# EAGLE design CPLD (EAGLE 7.5.0)
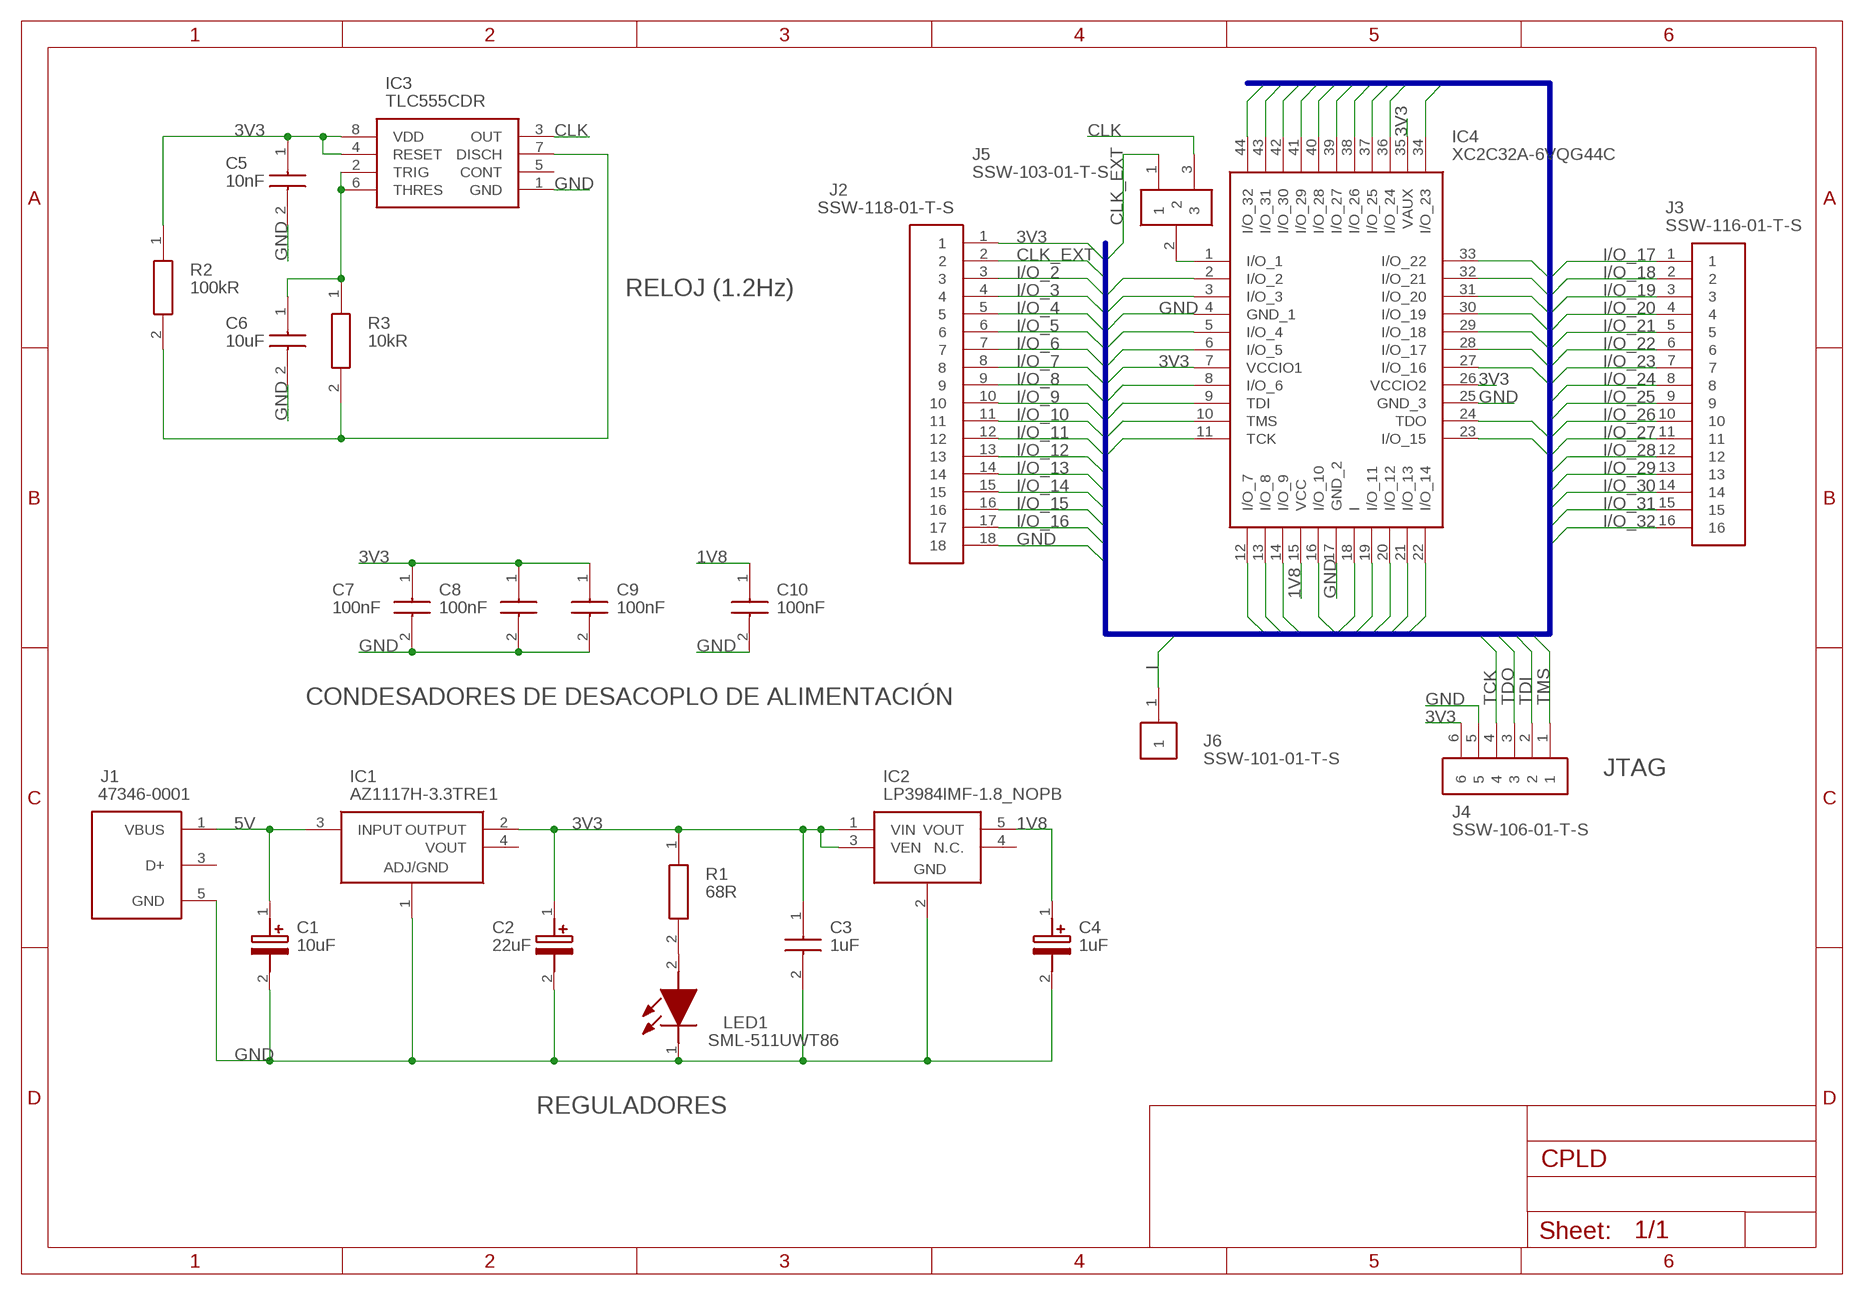
[diagram p0: schematic, sheet 1]

## Parts
C1  10uF  293D106X9016A2TE3  [CAPPM3216X180N]
C2  22uF  293D226X9010A2TE3  [CAPPM3216X180N]
C3  1uF  0603ZD105KAT2A  [CAPC1608X90N]
C4  1uF  TAJA105K020RNJ  [CAPPM3216X180N]
C5  10nF  C0603C103K5RACTU  [CAPC1608X87N]
C6  10uF  C1608X5R0J106K080AB  [C1608_COMMERCIAL]
C7  100nF  C0603C104K4RACTU  [CAPC1608X95N]
C8  100nF  C0603C104K4RACTU  [CAPC1608X95N]
C9  100nF  C0603C104K4RACTU  [CAPC1608X95N]
C10  100nF  C0603C104K4RACTU  [CAPC1608X95N]
IC1  AZ1117H-3.3TRE1  [SOT230P700X180-4N]
IC2  LP3984IMF-1.8_NOPB  [SOT95P280X145-5N]
IC3  TLC555CDR  [SOIC127P600X175-8N]
IC4  XC2C32A-6VQG44C  [QFP80P1200X1200X120-44N]
J1  47346-0001  [47346-0001]
J2  SSW-118-01-T-S  [SAMTEC_SSW-118-01-T-S]
J3  SSW-116-01-T-S  [SAMTEC_SSW-116-01-T-S]
J4  SSW-106-01-T-S  [SAMTEC_SSW-106-01-T-S]
J5  SSW-103-01-T-S  [SAMTEC_SSW-103-01-T-S]
J6  SSW-101-01-T-S  [SSW-101-XX-YYY-S]
LED1  SML-511UWT86  [LEDC1608X65N]
R1  68R  CRG0603F68R  [RESC1608X55N]
R2  100kR  CRG0603F100K  [RESC1608X55N]
R3  10kR  CRCW060310K0FKEA  [RESC1608X50N]

## Nets
1V8 [Power]: C4.1(+) C10.1 IC2.5(VOUT) IC4.15(VCC)
3V3 [Power]: C2.1(+) C3.1 C5.1 C7.1 C8.1 C9.1 IC1.2(OUTPUT) IC2.1(VIN) IC2.3(VEN) IC3.4(RESET) IC3.8(VDD) IC4.7(VCCIO1) IC4.26(VCCIO2) IC4.35(VAUX) J2.1 J4.6 R1.1 R2.1
5V [Power]: C1.1(+) IC1.3(INPUT) J1.1(VBUS)
CLK [Signal]: IC3.3(OUT) J5.3
CLK_EXT [Signal]: J2.2 J5.1
GND [Power]: C1.2(-) C2.2(-) C3.2 C4.2(-) C5.2 C6.2 C7.2 C8.2 C9.2 C10.2 IC1.1(ADJ/GND) IC2.2(GND) IC3.1(GND) IC4.4(GND_1) IC4.17(GND_2) IC4.25(GND_3) J1.5(GND) J2.18 J4.5 LED1.1(K)
I: IC4.18(I) J6.1
I/O_2 [Signal]: IC4.2(I/O_2) J2.3
I/O_3 [Signal]: IC4.3(I/O_3) J2.4
I/O_4 [Signal]: IC4.5(I/O_4) J2.5
I/O_5 [Signal]: IC4.6(I/O_5) J2.6
I/O_6 [Signal]: IC4.8(I/O_6) J2.7
I/O_7 [Signal]: IC4.12(I/O_7) J2.8
I/O_8 [Signal]: IC4.13(I/O_8) J2.9
I/O_9 [Signal]: IC4.14(I/O_9) J2.10
I/O_10 [Signal]: IC4.16(I/O_10) J2.11
I/O_11 [Signal]: IC4.19(I/O_11) J2.12
I/O_12 [Signal]: IC4.20(I/O_12) J2.13
I/O_13 [Signal]: IC4.21(I/O_13) J2.14
I/O_14 [Signal]: IC4.22(I/O_14) J2.15
I/O_15 [Signal]: IC4.23(I/O_15) J2.16
I/O_16 [Signal]: IC4.27(I/O_16) J2.17
I/O_17 [Signal]: IC4.28(I/O_17) J3.1
I/O_18 [Signal]: IC4.29(I/O_18) J3.2
I/O_19 [Signal]: IC4.30(I/O_19) J3.3
I/O_20 [Signal]: IC4.31(I/O_20) J3.4
I/O_21 [Signal]: IC4.32(I/O_21) J3.5
I/O_22 [Signal]: IC4.33(I/O_22) J3.6
I/O_23 [Signal]: IC4.34(I/O_23) J3.7
I/O_24 [Signal]: IC4.36(I/O_24) J3.8
I/O_25 [Signal]: IC4.37(I/O_25) J3.9
I/O_26 [Signal]: IC4.38(I/O_26) J3.10
I/O_27 [Signal]: IC4.39(I/O_27) J3.11
I/O_28 [Signal]: IC4.40(I/O_28) J3.12
I/O_29 [Signal]: IC4.41(I/O_29) J3.13
I/O_30 [Signal]: IC4.42(I/O_30) J3.14
I/O_31 [Signal]: IC4.43(I/O_31) J3.15
I/O_32 [Signal]: IC4.44(I/O_32) J3.16
N$3 [Signal]: C6.1 IC3.2(TRIG) IC3.6(THRES) R3.1
N$4: LED1.2(A) R1.2
N$5 [Signal]: IC3.7(DISCH) R2.2 R3.2
N$6 [Signal]: IC4.1(I/O_1) J5.2
TCK [Signal]: IC4.11(TCK) J4.4
TDI [Signal]: IC4.9(TDI) J4.2
TDO [Signal]: IC4.24(TDO) J4.3
TMS [Signal]: IC4.10(TMS) J4.1
Unconnected: IC1.4(VOUT) IC2.4(N.C.) IC3.5(CONT) J1.3(D+)

## Buses
I/O_[2..32],TDI,TMS,TCK,TDO,3V3,GND,CLK_EXT,I

## Notes on the sheet
- RELOJ (1.2Hz)
- CONDESADORES DE DESACOPLO DE ALIMENTACIÓN
- JTAG
- REGULADORES

## Library data of the parts
C1 = SamacSys_Parts:293D106X9016A2TE3: Capacitor Tantalum SMT 293D 16V 10uF Vishay 10uF SMD Solid MnO2 Tantalum Electrolytic Capacitor, 16 V dc +/-10%, 293D Series Source: Datasheet <http://uk.rs-online.com/web/p/products/6843890P>; ALLIED_NUMBER: 70212834; DESCRIPTION: Capacitor Tantalum SMT 293D 16V 10uF Vishay 10uF SMD Solid MnO2 Tantalum Electrolytic Capacitor, 16 V dc +/-10%, 293D Series; HEIGHT: 1.8mm; MANUFACTURER_NAME: Vishay; MANUFACTURER_PART_NUMBER: 293D106X9016A2TE3; RS_PART_NUMBER: 6843890P; RS_PRICE-STOCK: http://uk.rs-online.com/web/p/products/6843890P
C2 = SamacSys_Parts:293D226X9010A2TE3: Solid Tantalum Surface Mount Chip Capacitors TANTAMOUNT(TM), Molded Case, Standard Industrial Grade Source: Datasheet <http://uk.rs-online.com/web/p/products/6844017P>; ALLIED_NUMBER: 70398885; DESCRIPTION: Solid Tantalum Surface Mount Chip Capacitors TANTAMOUNT(TM), Molded Case, Standard Industrial Grade; HEIGHT: 1.8mm; MANUFACTURER_NAME: Vishay; MANUFACTURER_PART_NUMBER: 293D226X9010A2TE3; RS_PART_NUMBER: 6844017P; RS_PRICE-STOCK: http://uk.rs-online.com/web/p/products/6844017P
C3 = SamacSys_Parts:0603ZD105KAT2A: AVX 1uF /-10% 10 V dc X5R Dielectric SMD Ceramic Multilayer Capacitor 0603 Source: Datasheet <http://datasheets.avx.com/cx5r.pdf>; DESCRIPTION: AVX 1uF /-10% 10 V dc X5R Dielectric SMD Ceramic Multilayer Capacitor 0603; HEIGHT: 0.9mm; MANUFACTURER_NAME: AVX; MANUFACTURER_PART_NUMBER: 0603ZD105KAT2A; MOUSER_PART_NUMBER: 581-0603ZD105K; MOUSER_PRICE-STOCK: https://www.mouser.co.uk/ProductDetail/AVX/0603ZD105KAT2A?qs=9PmLU43%252BWwW9M7%2FQGmdczg%3D%3D
C4 = SamacSys_Parts:TAJA105K020RNJ: TAJ SMT tant capacitor,Case A,20V,1uF AVX /-10% 1uF 20 V dc SMD Tantalum Electrolytic Capacitor, 3216-18 ESR 9Ohm +125degC TAJ Source: Datasheet <http://uk.rs-online.com/web/p/products/4649053P>; ALLIED_NUMBER: 70002325; DESCRIPTION: TAJ SMT tant capacitor,Case A,20V,1uF AVX /-10% 1uF 20 V dc SMD Tantalum Electrolytic Capacitor, 3216-18 ESR 9Ohm +125degC TAJ; HEIGHT: 1.8mm; MANUFACTURER_NAME: AVX; MANUFACTURER_PART_NUMBER: TAJA105K020RNJ; RS_PART_NUMBER: 4649053P; RS_PRICE-STOCK: http://uk.rs-online.com/web/p/products/4649053P
C5 = SamacSys_Parts:C0603C103K5RACTU: 0603 X7R ceramic capacitor, 50V 10nF Kemet 0603 10nF Ceramic Multilayer Capacitor, 50V dc, 125C, X7R Dielectric, +/-10% SMD Source: Datasheet <http://uk.rs-online.com/web/p/products/2644595P>; ALLIED_NUMBER: 70096891; DESCRIPTION: 0603 X7R ceramic capacitor, 50V 10nF Kemet 0603 10nF Ceramic Multilayer Capacitor, 50V dc, 125C, X7R Dielectric, +/-10% SMD; HEIGHT: 0.87mm; MANUFACTURER_NAME: Kemet; MANUFACTURER_PART_NUMBER: C0603C103K5RACTU; RS_PART_NUMBER: 2644595P; RS_PRICE-STOCK: http://uk.rs-online.com/web/p/products/2644595P
C6 = SamacSys_Parts:C1608X5R0J106K080AB: MULTILAYER CERAMIC CHIP CAPACITORS, 1608, Commercial grade, general (Up to 75V) Source: Datasheet <http://uk.rs-online.com/web/p/products/7882887P>; DESCRIPTION: MULTILAYER CERAMIC CHIP CAPACITORS, 1608, Commercial grade, general (Up to 75V); HEIGHT: 0.9mm; MANUFACTURER_NAME: TDK; MANUFACTURER_PART_NUMBER: C1608X5R0J106K080AB; RS_PART_NUMBER: 7882887P; RS_PRICE-STOCK: http://uk.rs-online.com/web/p/products/7882887P
C7-C10 = SamacSys_Parts:C0603C104K4RACTU: 0603 X7R ceramic capacitor, 16V 100nF Kemet 0603 0.1??F Ceramic Multilayer Capacitor, 16V dc X7R Dielectric ??10% SMD Source: Datasheet <http://uk.rs-online.com/web/p/products/2644630P>; ALLIED_NUMBER: 70096893; DESCRIPTION: 0603 X7R ceramic capacitor, 16V 100nF Kemet 0603 0.1??F Ceramic Multilayer Capacitor, 16V dc X7R Dielectric ??10% SMD; HEIGHT: 0.95mm; MANUFACTURER_NAME: Kemet; MANUFACTURER_PART_NUMBER: C0603C104K4RACTU; RS_PART_NUMBER: 2644630P; RS_PRICE-STOCK: http://uk.rs-online.com/web/p/products/2644630P
IC1 = SamacSys_Parts:AZ1117H-3.3TRE1: 3.3V 1A Pos LDO Regulator SOT-223 DiodesZetex AZ1117H-3.3TRE1, LDO Voltage Regulator, 1A, 3.3 V 1%, maximum of 15 Vin, 3+Tab-Pin SOT-223 Source: Datasheet <http://uk.rs-online.com/web/p/products/9210701P>; DESCRIPTION: 3.3V 1A Pos LDO Regulator SOT-223 DiodesZetex AZ1117H-3.3TRE1, LDO Voltage Regulator, 1A, 3.3 V 1%, maximum of 15 Vin, 3+Tab-Pin SOT-223; HEIGHT: 1.8mm; MANUFACTURER_NAME: Diodes Inc.; MANUFACTURER_PART_NUMBER: AZ1117H-3.3TRE1; RS_PART_NUMBER: 9210701P; RS_PRICE-STOCK: http://uk.rs-online.com/web/p/products/9210701P
IC2 = SamacSys_Parts:LP3984IMF-1.8_NOPB: 150mA,1.8V,LDO Voltage Reg,LP3984IMF-1.8 Source: Datasheet <http://uk.rs-online.com/web/p/products/5360830P>; DESCRIPTION: 150mA,1.8V,LDO Voltage Reg,LP3984IMF-1.8; HEIGHT: 1.45mm; MANUFACTURER_NAME: Texas Instruments; MANUFACTURER_PART_NUMBER: LP3984IMF-1.8/NOPB; RS_PART_NUMBER: 5360830P; RS_PRICE-STOCK: http://uk.rs-online.com/web/p/products/5360830P
IC3 = SamacSys_Parts:TLC555CDR: TLC555CDR, Timer 2MHz, 2 ??? 15 V, 8-Pin SOIC-8 Source: Datasheet <http://uk.rs-online.com/web/p/products/6624006P>; DESCRIPTION: TLC555CDR, Timer 2MHz, 2 ??? 15 V, 8-Pin SOIC-8; HEIGHT: 1.75mm; MANUFACTURER_NAME: Texas Instruments; MANUFACTURER_PART_NUMBER: TLC555CDR; RS_PART_NUMBER: 6624006P; RS_PRICE-STOCK: http://uk.rs-online.com/web/p/products/6624006P
IC4 = SamacSys_Parts:XC2C32A-6VQG44C: CoolRunner II 32 macrocells VQFP XC2C32A-6VQG44C, CPLD CoolRunner II 32 Cells, 33 I/O, 2 Labs, ISP, 1.7 1.9 V 44-Pin VTQFP Source: Datasheet <https://www.xilinx.com/support/documentation/package_specs/vq44.pdf>; DESCRIPTION: CoolRunner II 32 macrocells VQFP XC2C32A-6VQG44C, CPLD CoolRunner II 32 Cells, 33 I/O, 2 Labs, ISP, 1.7 1.9 V 44-Pin VTQFP; HEIGHT: 1.2mm; MANUFACTURER_NAME: XILINX; MANUFACTURER_PART_NUMBER: XC2C32A-6VQG44C; MOUSER_PART_NUMBER: 217-XC2C32A-6VQG44C; MOUSER_PRICE-STOCK: https://www.mouser.co.uk/ProductDetail/Xilinx/XC2C32A-6VQG44C?qs=rrS6PyfT74eChICnO6BLUg%3D%3D
J1 = SamacSys_Parts:47346-0001: Micro USB B Receptacle Bottom Mount Assy Molex Right Angle SMT Type B Version 2.0 Micro USB Connector Socket, 30 V ac, 1A 47352 MICRO-USB Source: Datasheet <http://www.molex.com/pdm_docs/sd/473460001_sd.pdf>; DESCRIPTION: Micro USB B Receptacle Bottom Mount Assy Molex Right Angle SMT Type B Version 2.0 Micro USB Connector Socket, 30 V ac, 1A 47352 MICRO-USB; HEIGHT: mm; MANUFACTURER_NAME: Molex; MANUFACTURER_PART_NUMBER: 47346-0001; MOUSER_PART_NUMBER: 538-47346-0001; MOUSER_PRICE-STOCK: https://www.mouser.co.uk/ProductDetail/Molex/47346-0001?qs=c2CV6XM0DweJBWaSeyWeCw%3D%3D
J2 = SamacSys_Parts:SSW-118-01-T-S: 18 Position, .100" Tiger Buy™ Socket Strip Source: Datasheet <http://suddendocs.samtec.com/prints/ssw-1xx-xx-xxx-x-xx-xxx-xx-mkt.pdf>; DESCRIPTION: 18 Position, .100&quot; Tiger Buy&trade; Socket Strip; HEIGHT: mm; MANUFACTURER_NAME: SAMTEC; MANUFACTURER_PART_NUMBER: SSW-118-01-T-S; MOUSER_PART_NUMBER: 200-SSW11801TS; MOUSER_PRICE-STOCK: https://www.mouser.co.uk/ProductDetail/Samtec/SSW-118-01-T-S?qs=rU5fayqh%252BE3cHws7SblMBw%3D%3D
J3 = SamacSys_Parts:SSW-116-01-T-S: 16 Position, .100" Tiger Buy™ Socket Strip Source: Datasheet <http://uk.rs-online.com/web/p/products/1800453>; DESCRIPTION: 16 Position, .100&quot; Tiger Buy&trade; Socket Strip; HEIGHT: mm; MANUFACTURER_NAME: SAMTEC; MANUFACTURER_PART_NUMBER: SSW-116-01-T-S; RS_PART_NUMBER: 1800453; RS_PRICE-STOCK: http://uk.rs-online.com/web/p/products/1800453
J4 = SamacSys_Parts:SSW-106-01-T-S: 6 Position, .100" Tiger Buy™ Socket Strip Source: Datasheet <http://uk.rs-online.com/web/p/products/1557894>; DESCRIPTION: 6 Position, .100&quot; Tiger Buy&trade; Socket Strip; HEIGHT: mm; MANUFACTURER_NAME: SAMTEC; MANUFACTURER_PART_NUMBER: SSW-106-01-T-S; RS_PART_NUMBER: 1557894; RS_PRICE-STOCK: http://uk.rs-online.com/web/p/products/1557894
J5 = SamacSys_Parts:SSW-103-01-T-S: 3 Position, .100" Tiger Buy™ Socket Strip Source: Datasheet <http://uk.rs-online.com/web/p/products/1800408>; DESCRIPTION: 3 Position, .100&quot; Tiger Buy&trade; Socket Strip; HEIGHT: mm; MANUFACTURER_NAME: SAMTEC; MANUFACTURER_PART_NUMBER: SSW-103-01-T-S; RS_PART_NUMBER: 1800408; RS_PRICE-STOCK: http://uk.rs-online.com/web/p/products/1800408
J6 = SamacSys_Parts:SSW-101-01-T-S: 1 Position, .100" Tiger Buy™ Socket Strip Source: Datasheet <http://suddendocs.samtec.com/prints/ssw-1xx-xx-xxx-x-xx-xxx-xx-mkt.pdf>; DESCRIPTION: 1 Position, .100&quot; Tiger Buy&trade; Socket Strip; HEIGHT: mm; MANUFACTURER_NAME: SAMTEC; MANUFACTURER_PART_NUMBER: SSW-101-01-T-S; MOUSER_PART_NUMBER: 200-SSW10101TS; MOUSER_PRICE-STOCK: https://www.mouser.co.uk/ProductDetail/Samtec/SSW-101-01-T-S/?qs=rU5fayqh%252BE2KqcuVZzybJQ%3D%3D
LED1 = SamacSys_Parts:SML-511UWT86: ROHM SML-511UWT86, SML-51 Series Red LED, 1608 (0603), Rectangle Lens SMD Package Source: Datasheet <http://uk.rs-online.com/web/p/products/7007966P>; ALLIED_NUMBER: 70522043; DESCRIPTION: ROHM SML-511UWT86, SML-51 Series Red LED, 1608 (0603), Rectangle Lens SMD Package; HEIGHT: 0.65mm; MANUFACTURER_NAME: ROHM Semiconductor; MANUFACTURER_PART_NUMBER: SML-511UWT86; RS_PART_NUMBER: 7007966P; RS_PRICE-STOCK: http://uk.rs-online.com/web/p/products/7007966P
R1 = SamacSys_Parts:CRG0603F68R: CRG0603 SMT chip resistor,68R 1% 0.1W TE Connectivity CRG0603 Series Thick Film Surface Mount Resistor 0603 Case 68 +/-1% 0.1W +/-200ppm/C Source: Datasheet <http://uk.rs-online.com/web/p/products/2132115P>; ALLIED_NUMBER: 70063170; DESCRIPTION: CRG0603 SMT chip resistor,68R 1% 0.1W TE Connectivity CRG0603 Series Thick Film Surface Mount Resistor 0603 Case 68 +/-1% 0.1W +/-200ppm/C; HEIGHT: 0.55mm; MANUFACTURER_NAME: TE Connectivity; MANUFACTURER_PART_NUMBER: CRG0603F68R; RS_PART_NUMBER: 2132115P; RS_PRICE-STOCK: http://uk.rs-online.com/web/p/products/2132115P
R2 = SamacSys_Parts:CRG0603F100K: CRG0603 SMT chip resistor,100K 1% 0.1W TE Connectivity CRG0603 Series Thick Film Surface Mount Resistor 0603 Case 100k +/-1% 0.1W +/-100ppm/C Source: Datasheet <http://uk.rs-online.com/web/p/products/2132531P>; ALLIED_NUMBER: 70063119; DESCRIPTION: CRG0603 SMT chip resistor,100K 1% 0.1W TE Connectivity CRG0603 Series Thick Film Surface Mount Resistor 0603 Case 100k +/-1% 0.1W +/-100ppm/C; HEIGHT: 0.55mm; MANUFACTURER_NAME: TE Connectivity; MANUFACTURER_PART_NUMBER: CRG0603F100K; RS_PART_NUMBER: 2132531P; RS_PRICE-STOCK: http://uk.rs-online.com/web/p/products/2132531P
R3 = SamacSys_Parts:CRCW060310K0FKEA: CRCW0603 Resistor T/R 0.10W,1%,10K Vishay CRCW Series Thick Film Surface Mount Resistor 0603 Case 10k +/-1% 0.1W +/-100ppm/C Source: Datasheet <http://uk.rs-online.com/web/p/products/6789667P>; ALLIED_NUMBER: 70201153; DESCRIPTION: CRCW0603 Resistor T/R 0.10W,1%,10K Vishay CRCW Series Thick Film Surface Mount Resistor 0603 Case 10k +/-1% 0.1W +/-100ppm/C; HEIGHT: 0.5mm; MANUFACTURER_NAME: Vishay; MANUFACTURER_PART_NUMBER: CRCW060310K0FKEA; RS_PART_NUMBER: 6789667P; RS_PRICE-STOCK: http://uk.rs-online.com/web/p/products/6789667P

## Board
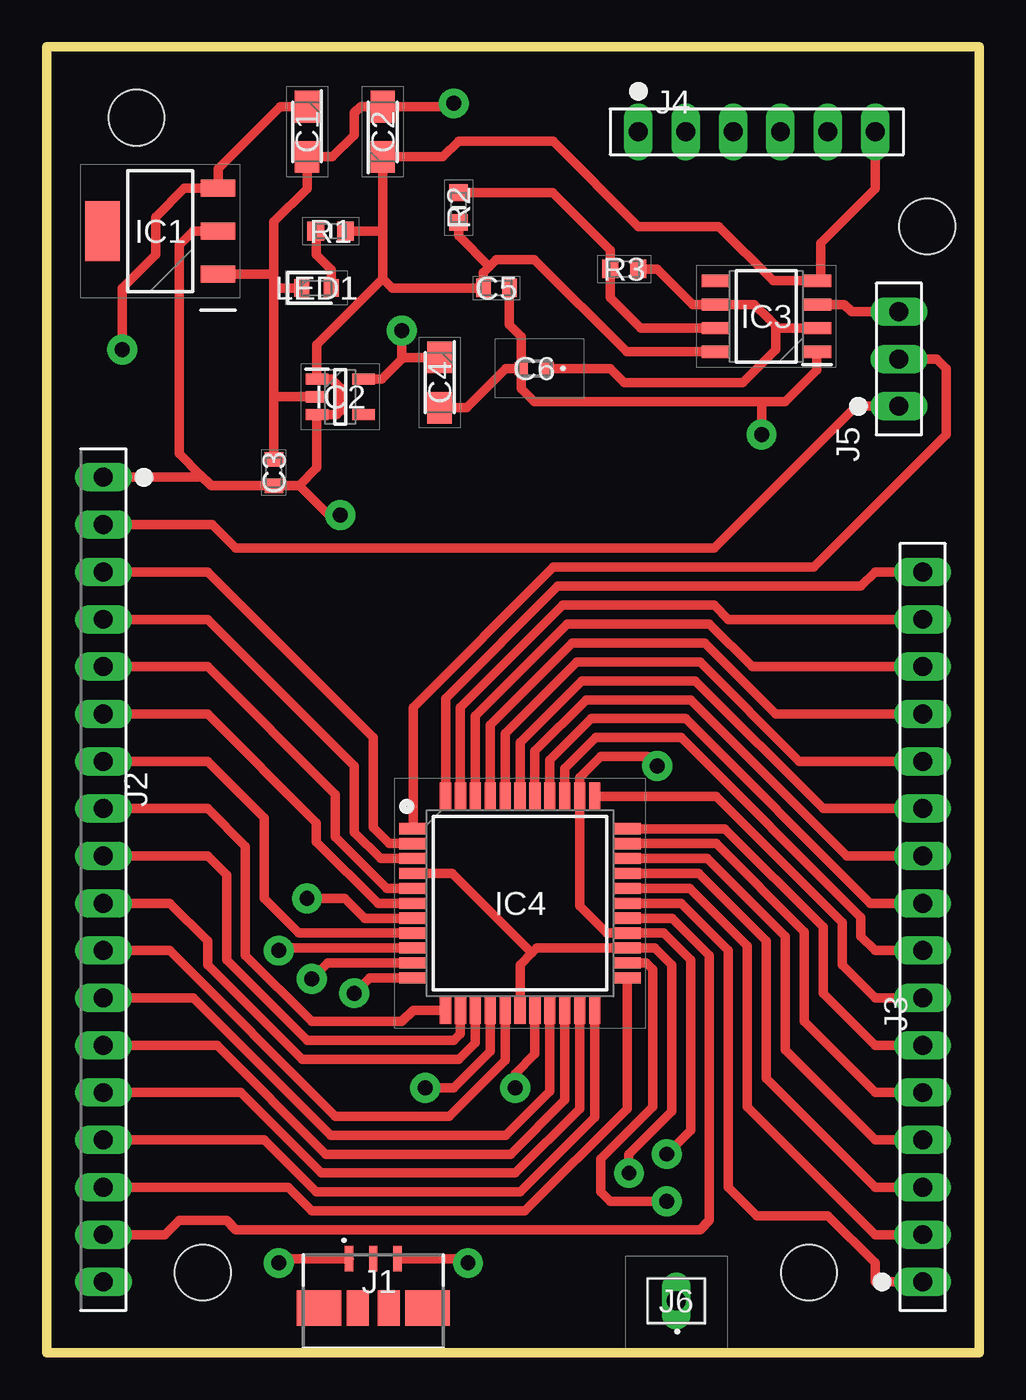
[diagram p1: board, top side]
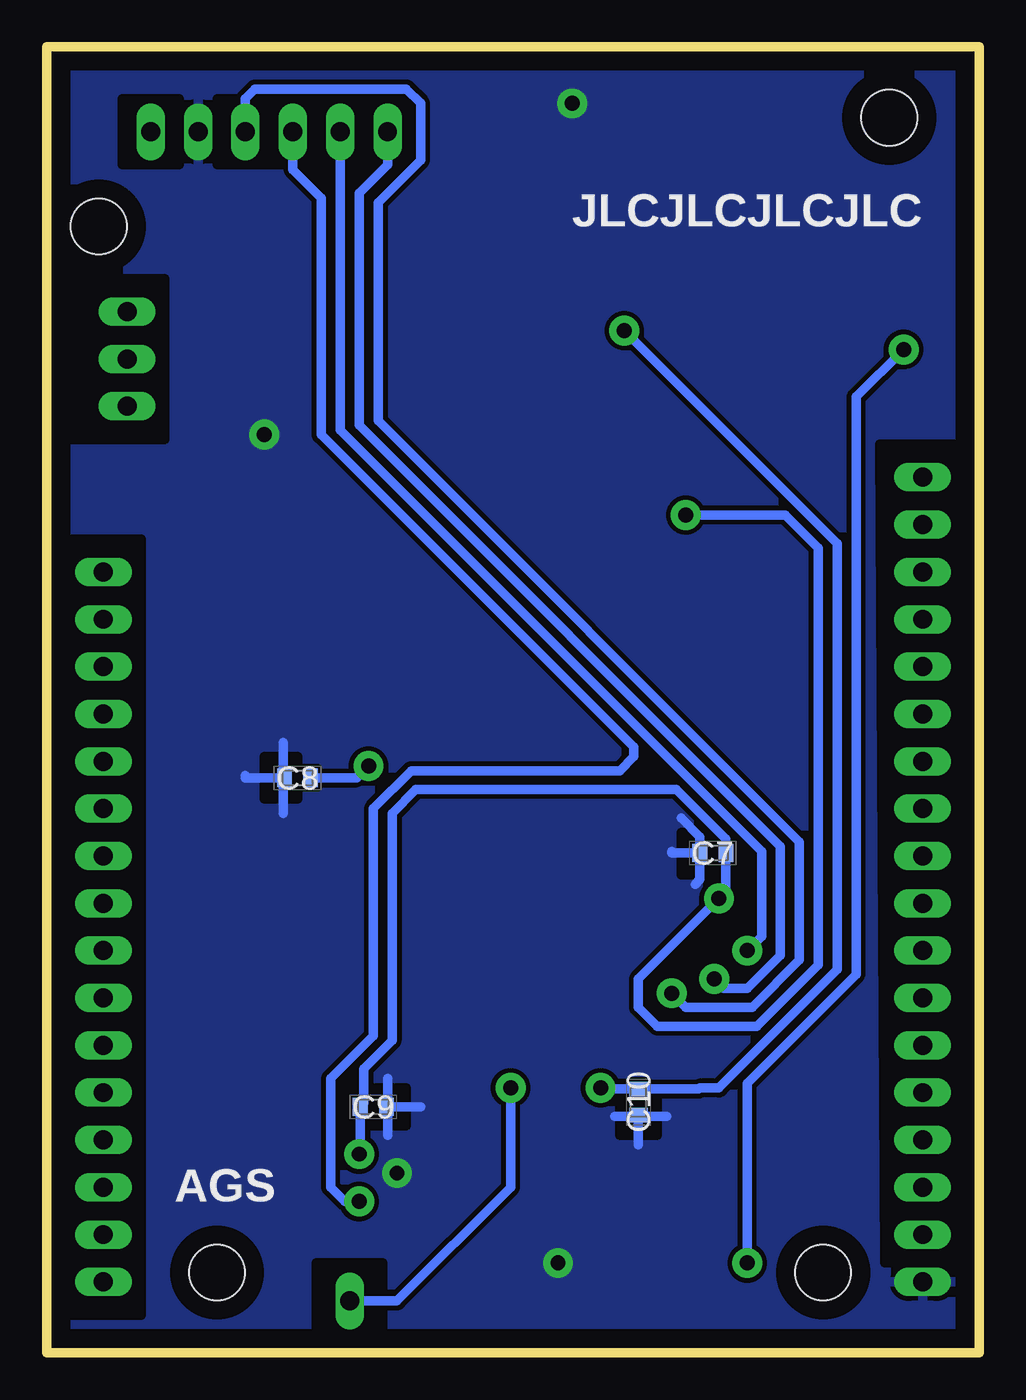
[diagram p2: board, bottom side, seen from below]

Size 50.04 x 70.1 mm. Coordinates in mm from the lower left corner, seen from the top.
Outline: 0,0 50.04,0 50.04,70.1 0,70.1 0,0
Copper layers (1*16): Top 0.035mm / dielectric 1.5mm / Bottom 0.035mm
Design rules "default *": minimum track width 10mil, minimum drill 24mil, track to track 10mil, track to pad 9mil, pad to pad 7mil, via to via 10mil, smd to smd 10mil, copper to edge 40mil, drill to drill 8mil, minimum pad ring 10mil, minimum via ring 8mil, stop-mask expansion 4mil, vias tented up to drill 0mil, thermal gap 10mil
Holes 3 mm at 4.83,66.29 47.24,60.45 8.38,4.32 40.89,4.32
bRestrict: area 37.6,63.8 to 40.9,67.3; area 42.9,63.8 to 46,67.3; area 1.3,4.8 to 5.3,48.8; area 45,2 to 48.8,43.7; area 43.7,49 to 48.8,57.7; area 32,1 to 35.6,4.8; area 36.6,29.7 to 38.4,32; area 17.3,11.7 to 19.3,13.5; area 14.2,25.7 to 16,27.9; area 30.7,12.2 to 32.5,14.2

### Footprints (pad centres in the part's own frame; a part is rotated, then mirrored left to right if it is on the bottom)
CAPPM3216X180N = smd 1.7 x 1.3: 1 -1.35,0; 2 1.35,0
CAPC1608X90N = smd 0.78 x 0.99: 1 -0.7,0; 2 0.7,0
CAPC1608X87N = smd 0.78 x 0.98: 1 -0.7,0; 2 0.7,0
C1608_COMMERCIAL = smd 0.7 x 0.7: 1 -0.7,0; 2 0.7,0
CAPC1608X95N = smd 0.78 x 0.98: 1 -0.7,0; 2 0.7,0
SOT230P700X180-4N = smd 1.85 x 0.9: 1 -3.1,2.3; 2 -3.1,0; 3 -3.1,-2.3 | smd 1.85 x 3.2: 4 3.1,0
SOT95P280X145-5N = smd 1.2 x 0.6: 1 -1.25,0.95; 2 -1.25,0; 3 -1.25,-0.95; 4 1.25,-0.95; 5 1.25,0.95
SOIC127P600X175-8N = smd 1.525 x 0.65: 1 -2.712,1.905; 2 -2.712,0.635; 3 -2.712,-0.635; 4 -2.712,-1.905; 5 2.712,-1.905; 6 2.712,-0.635; 7 2.712,0.635; 8 2.712,1.905
QFP80P1200X1200X120-44N = smd 1.475 x 0.6: 1 -5.738,4; 2 -5.738,3.2; 3 -5.738,2.4; 4 -5.738,1.6; 5 -5.738,0.8; 6 -5.738,0; 7 -5.738,-0.8; 8 -5.738,-1.6; 9 -5.738,-2.4; 10 -5.738,-3.2; 11 -5.738,-4; 23 5.738,-4; 24 5.738,-3.2; 25 5.738,-2.4; 26 5.738,-1.6; 27 5.738,-0.8; 28 5.738,0; 29 5.738,0.8; 30 5.738,1.6; 31 5.738,2.4; 32 5.738,3.2; 33 5.738,4 | smd 0.6 x 1.475: 12 -4,-5.738; 13 -3.2,-5.738; 14 -2.4,-5.738; 15 -1.6,-5.738; 16 -0.8,-5.738; 17 0,-5.738; 18 0.8,-5.738; 19 1.6,-5.738; 20 2.4,-5.738; 21 3.2,-5.738; 22 4,-5.738; 34 4,5.738; 35 3.2,5.738; 36 2.4,5.738; 37 1.6,5.738; 38 0.8,5.738; 39 0,5.738; 40 -0.8,5.738; 41 -1.6,5.738; 42 -2.4,5.738; 43 -3.2,5.738; 44 -4,5.738
47346-0001 = smd 0.45 x 1.38: 1 1.3,-4.81; 3 0,-4.81; 5 -1.3,-4.81 | smd 1.175 x 1.9: 8 0.838,-2.15; 9 -0.838,-2.15 | smd 2.375 x 1.9: 10 2.913,-2.15; 11 -2.913,-2.15
SAMTEC_SSW-118-01-T-S = drill 1.016 pad 1.524 long: 1 -43.18,0; 2 -40.64,0; 3 -38.1,0; 4 -35.56,0; 5 -33.02,0; 6 -30.48,0; 7 -27.94,0; 8 -25.4,0; 9 -22.86,0; 10 -20.32,0; 11 -17.78,0; 12 -15.24,0; 13 -12.7,0; 14 -10.16,0; 15 -7.62,0; 16 -5.08,0; 17 -2.54,0; 18 0,0
SAMTEC_SSW-116-01-T-S = drill 1.016 pad 1.524 long: 1 -38.1,0; 2 -35.56,0; 3 -33.02,0; 4 -30.48,0; 5 -27.94,0; 6 -25.4,0; 7 -22.86,0; 8 -20.32,0; 9 -17.78,0; 10 -15.24,0; 11 -12.7,0; 12 -10.16,0; 13 -7.62,0; 14 -5.08,0; 15 -2.54,0; 16 0,0
SAMTEC_SSW-106-01-T-S = drill 1.016 pad 1.524 long: 1 -12.7,0; 2 -10.16,0; 3 -7.62,0; 4 -5.08,0; 5 -2.54,0; 6 0,0
SAMTEC_SSW-103-01-T-S = drill 1.016 pad 1.524 long: 1 -5.08,0; 2 -2.54,0; 3 0,0
SSW-101-XX-YYY-S = drill 1.016 pad 1.524 long: 1 0,0
LEDC1608X65N = smd 0.8 x 0.95: 1 -0.8,0; 2 0.8,0
RESC1608X55N = smd 0.9 x 1: 1 -0.8,0; 2 0.8,0
RESC1608X50N = smd 0.85 x 1: 1 -0.75,0; 2 0.75,0

### Placement (x,y rotation side)
C1  13.97,65.53 270 top
C2  18.03,65.53 90 top
C3  12.19,47.24 90 top
C4  21.08,52.07 270 top
C5  24.13,57.15 0 top
C6  26.16,52.83 180 top
C7  14.3,26.84 180 bottom
C8  36.58,30.86 180 bottom
C9  32.51,13.21 0 bottom
C10  18.29,13.46 270 bottom
IC1  6.1,60.2 180 top
IC2  15.75,51.31 0 top
IC3  38.61,55.63 180 top
IC4  25.4,24.13 0 top
J1  17.53,0.25 180 top
J2  3.05,3.81 270 top
J3  46.99,41.91 90 top
J4  44.45,65.53 0 top
J5  45.72,55.88 90 top
J6  33.78,2.79 0 top
LED1  14.48,57.15 0 top
R1  15.24,60.2 180 top
R2  22.1,61.47 90 top
R3  30.99,58.17 180 top

### Tracks (layer width: path | path; a pad name or v marks a point on that pad's centre or on a via)
1V8  (via drill 0.8 pad 1.6)
  Top 0.508: IC4.15 23.8,16.18 21.84,14.22 v20.32,14.22 | C4.1 19.13,53.42 19.05,53.34 | IC2.5 17.97,52.26 19.05,53.34 | 19.05,53.34 v19.05,54.86
  Bottom 0.508: v20.32,14.22 20.26,14.16 C10.1 15.05,14.16 14.99,14.22 13.97,14.22 7.62,20.57 7.62,43.43 v19.05,54.86
3V3  (via drill 0.8 pad 1.6)
  Top 0.508: 23.75,58.29 23.43,57.97 C5.1 18.54,57.15 18.03,57.66 | 23.75,58.29 24.13,58.67 26.16,58.67 31.11,53.72 IC3.8 | 18.03,60.2 C2.1 21.26,64.18 22.1,65.02 27.18,65.02 31.75,60.45 36.07,60.45 38.99,57.53 IC3.4 41.53,57.53 41.53,59.56 44.45,62.48 J4.6 | IC1.2 7.87,60.2 7.11,59.44 7.11,48.26 8.26,47.12 | R2.1 22.1,59.94 23.75,58.29 | v33.27,10.67 34.54,11.94 34.54,21.08 33.1,22.53 IC4.26 30.05,22.53 28.6,23.98 IC4.35 28.6,30.89 29.72,32 32.26,32 v32.77,31.5 | IC4.7 17.06,23.33 16,24.38 v13.97,24.38 | 13.54,46.54 C3.1 8.83,46.54 8.26,47.12 | 13.54,46.54 14.5,47.5 IC2.3 15.56,50.36 15.75,50.55 15.75,51.82 15.31,52.26 IC2.1 14.5,54.12 18.03,57.66 | v15.75,44.96 15.13,44.96 13.54,46.54 | R1.1 18.03,60.2 | J2.1 8.13,46.99 8.26,47.12 | 18.03,60.2 18.03,57.66
  Bottom 0.508: v32.77,31.5 33.4,30.86 C8.1 | v33.27,10.67 33.21,10.73 C9.1 33.02,13.4 33.02,15.24 31.5,16.76 31.5,28.96 30.23,30.23 16.26,30.23 13.6,27.57 C7.1 13.6,24.75 v13.97,24.38 18.29,20.07 18.29,18.54 17.27,17.53 11.94,17.53 8.64,20.83 8.64,43.18 10.41,44.96 v15.75,44.96
5V  (via drill 0.8 pad 1.6)
  Top 0.508: v4.06,53.85 4.06,57.15 5.84,58.93 5.84,60.96 7.38,62.5 IC1.3 | IC1.3 9.59,62.5 | C1.1 12.53,66.88 9.2,63.55 IC1.3 | J1.1 12.72,5.06 12.48,4.83 v12.45,4.83
  Bottom 0.508: v4.06,53.85 6.6,51.31 6.6,20.32 12.45,14.48 v12.45,4.83
CLK
  Top 0.508: IC3.3 42.8,56.26 43.18,55.88 J5.3
CLK_EXT
  Top 0.508: J5.1 43.43,50.8 35.81,43.18 10.16,43.18 8.89,44.45 J2.2
GND  (via drill 0.8 pad 1.6)
  Top 0.508: C3.2 12.19,51.31 | 12.19,51.31 12.19,57.15 | 12.19,57.15 12.19,57.91 | IC3.1 41.32,52.75 39.62,51.05 38.35,51.05 | v21.84,67.06 21.67,66.88 C2.2 16.84,66.88 16.51,66.55 16.51,65.36 15.33,64.18 C1.2 13.97,62.48 12.19,60.71 12.19,57.91 | C6.2 25.46,54.55 24.83,55.18 C5.2 | J1.5 22.37,5.06 v22.61,4.83 | v31.24,9.65 31.24,10.67 33.53,12.95 33.53,20.83 32.63,21.73 IC4.25 26.3,21.73 26.04,21.46 | 26.04,21.46 25.4,20.83 IC4.17 | 26.04,21.46 21.77,25.73 IC4.4 | v38.35,49.28 38.35,51.05 | C4.2 22.53,50.72 24.64,52.83 C6.2 | LED1.1 12.19,57.15 | IC1.1 12.18,57.9 12.19,57.91 | C6.2 25.46,51.75 26.16,51.05 38.35,51.05 | IC2.2 12.19,51.31
  Bottom 0.508: C8.2 39.37,30.86 39.37,30.99 | 37.34,32.77 37.34,28.96 | 14.99,26.84 C7.2 16.51,26.84 16.51,26.92 | C9.2 31.75,13.21 | 29.97,13.21 31.75,13.21 | 31.75,13.21 31.75,14.73 | 31.75,13.21 31.75,11.68 | 16,28.7 14.99,27.69 14.99,25.4 15.24,25.15 | C10.2 18.29,12.7 | 18.29,11.18 18.29,12.7 | 16.76,12.7 18.29,12.7 | 18.29,12.7 19.56,12.7
  pour Bottom: 0,0 50.04,0 50.04,70.1 0,70.1
I  (via drill 0.8 pad 1.6)
  Top 0.508: IC4.18 26.2,16.04 25.15,14.99 v25.15,14.22
  Bottom 0.508: v25.15,14.22 25.15,8.89 31.24,2.79 J6.1
I/O_2
  Top 0.508: J2.3 8.64,41.91 17.53,33.02 17.53,28.19 18.39,27.33 IC4.2
I/O_3
  Top 0.508: J2.4 8.64,39.37 16.51,31.5 16.51,27.94 17.92,26.53 IC4.3
I/O_4
  Top 0.508: J2.5 8.64,36.83 15.49,29.97 15.49,27.69 18.25,24.93 IC4.5
I/O_5
  Top 0.508: IC4.6 17.78,24.13 14.48,27.43 14.48,28.45 8.64,34.29 J2.6
I/O_6
  Top 0.508: IC4.8 13.54,22.53 11.68,24.38 11.68,28.7 8.64,31.75 J2.7
I/O_7
  Top 0.508: IC4.12 19.66,18.39 19.05,17.78 14.22,17.78 10.67,21.34 10.67,27.18 8.64,29.21 J2.8
I/O_8
  Top 0.508: IC4.13 22.2,17.12 21.84,16.76 13.97,16.76 9.65,21.08 9.65,25.65 8.64,26.67 J2.9
I/O_9
  Top 0.508: IC4.14 23,16.65 22.1,15.75 13.72,15.75 8.64,20.83 8.64,22.1 6.6,24.13 J2.10
I/O_10
  Top 0.508: J2.11 6.6,21.59 15.49,12.7 21.59,12.7 24.6,15.71 IC4.16
I/O_11
  Top 0.508: IC4.19 27,14.05 24.64,11.68 15.24,11.68 7.87,19.05 J2.12
I/O_12
  Top 0.508: IC4.20 27.8,13.58 24.89,10.67 14.99,10.67 9.14,16.51 J2.13
I/O_13
  Top 0.508: IC4.21 28.6,13.11 25.15,9.65 14.73,9.65 10.41,13.97 J2.14
I/O_14
  Top 0.508: IC4.22 29.4,12.64 25.4,8.64 14.48,8.64 11.68,11.43 J2.15
I/O_15
  Top 0.508: IC4.23 31.14,13.1 25.65,7.62 14.22,7.62 12.95,8.89 J2.16
I/O_16
  Top 0.508: IC4.27 33.57,23.33 35.56,21.34 35.56,7.11 35.05,6.6 10.16,6.6 9.65,7.11 7.11,7.11 6.35,6.35 J2.17
I/O_17
  Top 0.508: IC4.28 34.04,24.13 36.58,21.59 36.58,8.89 38.1,7.37 41.91,7.37 44.45,4.83 44.45,3.81 J3.1
I/O_18
  Top 0.508: J3.2 44.45,6.35 37.59,13.21 37.59,21.84 34.51,24.93 IC4.29
I/O_19
  Top 0.508: IC4.30 34.98,25.73 38.61,22.1 38.61,14.73 44.45,8.89 J3.3
I/O_20
  Top 0.508: IC4.31 35.45,26.53 39.62,22.35 39.62,16.26 44.45,11.43 J3.4
I/O_21
  Top 0.508: IC4.32 35.92,27.33 40.64,22.61 40.64,17.78 44.45,13.97 J3.5
I/O_22
  Top 0.508: IC4.33 36.39,28.13 41.66,22.86 41.66,19.3 44.45,16.51 J3.6
I/O_23
  Top 0.508: IC4.34 35.92,29.87 42.67,23.11 42.67,20.83 44.45,19.05 J3.7
I/O_24
  Top 0.508: J3.8 44.45,21.59 43.69,22.35 43.69,23.37 34.04,33.02 29.46,33.02 27.8,31.36 IC4.36
I/O_25
  Top 0.508: J3.9 44.2,24.13 34.29,34.04 29.21,34.04 27,31.83 IC4.37
I/O_26
  Top 0.508: J3.10 42.93,26.67 34.54,35.05 28.96,35.05 26.2,32.3 IC4.38
I/O_27
  Top 0.508: J3.11 41.66,29.21 34.8,36.07 28.7,36.07 25.4,32.77 IC4.39
I/O_28
  Top 0.508: J3.12 40.39,31.75 35.05,37.08 28.45,37.08 24.6,33.24 IC4.40
I/O_29
  Top 0.508: J3.13 39.12,34.29 35.31,38.1 28.19,38.1 23.8,33.71 IC4.41
I/O_30
  Top 0.508: J3.14 37.85,36.83 35.56,39.12 27.94,39.12 23,34.18 IC4.42
I/O_31
  Top 0.508: J3.15 36.58,39.37 35.81,40.13 27.69,40.13 22.2,34.65 IC4.43
I/O_32
  Top 0.508: J3.16 44.45,41.91 43.69,41.15 27.43,41.15 21.4,35.12 IC4.44
N$3
  Top 0.508: R3.1 32.77,58.17 34.67,56.26 IC3.6 37.97,56.26 38.73,55.5 39.12,55.12 | IC3.2 39.24,54.99 39.12,55.12 | C6.1 30.23,52.83 30.99,52.07 37.34,52.07 39.12,53.85 39.12,55.12
N$4
  Top 0.508: LED1.2 15.28,58.13 14.48,58.93 14.48,60.16 R1.2
N$5
  Top 0.508: IC3.7 31.88,54.99 30.23,56.64 30.23,58.15 R3.2 30.24,59.17 27.14,62.27 R2.2
N$6
  Top 0.508: J5.2 47.75,53.34 48.26,52.83 48.26,49.28 41.15,42.16 27.18,42.16 19.66,34.65 IC4.1
TCK  (via drill 0.8 pad 1.6)
  Top 0.508: IC4.11 17.34,20.13 v16.51,19.3
  Bottom 0.508: J4.4 39.37,67.31 38.86,67.82 30.73,67.82 29.97,67.06 29.97,64.01 32.26,61.72 32.26,50.04 9.65,27.43 9.65,21.08 12.19,18.54 15.75,18.54 v16.51,19.3
TDI  (via drill 0.8 pad 1.6)
  Top 0.508: IC4.9 12.59,21.73 v12.45,21.59
  Bottom 0.508: J4.2 34.29,49.53 11.68,26.92 11.68,22.35 v12.45,21.59
TDO  (via drill 0.8 pad 1.6)
  Top 0.508: IC4.24 32.16,20.93 32.51,20.57 32.51,13.21 29.72,10.41 29.72,8.64 30.23,8.13 v33.27,8.13
  Bottom 0.508: J4.3 36.83,63.5 35.31,61.98 35.31,49.28 18.54,32.51 18.54,32 19.3,31.24 30.48,31.24 32.51,29.21 32.51,17.02 34.8,14.73 34.8,8.89 34.04,8.13 v33.27,8.13
TMS  (via drill 0.8 pad 1.6)
  Top 0.508: IC4.10 15.09,20.93 v14.22,20.07
  Bottom 0.508: J4.1 31.75,63.75 33.27,62.23 33.27,49.78 10.67,27.18 10.67,21.34 12.45,19.56 13.72,19.56 v14.22,20.07

### Text on the board
bPlace: JLCJLCJLCJLC | AGS